# Altium schematic sheet CHECK2.SchDoc
size A4
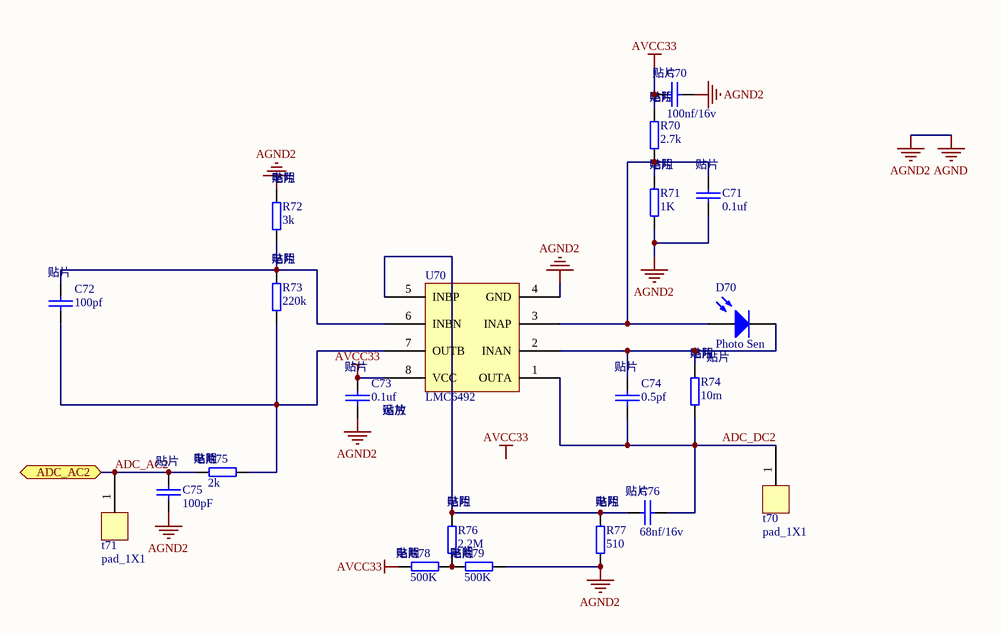
[diagram p0: CHECK2.SchDoc]

## Parts
C70  100nf/16v  [C0402]
C71  0.1uf  [C0402]
C72  100pf  [C0402]
C73  0.1uf  [C0402]
C74  0.5pf  [C0402]
C75  100pF  [C0402]
C76  68nf/16v  [C0402]
D70  Photo Sen  [PhotoSen]
R70  2.7k  [R0402]
R71  1K  [R0402]
R72  3k  [R0402]
R73  220k  [R0402]
R74  10m  [R0402]
R75  2k  [R0402]
R76  2.2M  [R0402]
R77  510  [R0402]
R78  500K  [R0402]
R79  500K  [R0402]
t70  pad_1X1  [pad_0603]
t71  pad_1X1  [pad_0603]
U70  LMC6492  [SO-8]

## Ports
ADC_AC2

## Nets
AGND: C70.2 C71.2 C73.2 C75.1 R71.2 R72.1 R77.2 R79.2 U70.4(GND)  [also labelled AGND2]
AVCC33: C70.1 C73.1 R70.1 R78.1 U70.8(VCC)
ADC_AC2: C75.2 R75.1 t71.1 ; port ADC_AC2
ADC_DC2: C74.2 C76.2 R74.2 t70.1 U70.1(OUTA)
NetC71_1: C71.1 D70.1(A) R70.2 R71.1 U70.3(INAP)
NetC72_1: C72.1 R72.2 R73.1 U70.6(INBN)
NetC72_2: C72.2 R73.2 R75.2 U70.7(OUTB)
NetC74_1: C74.1 D70.2(K) R74.1 U70.2(INAN)
NetC76_1: C76.1 R76.1 R77.1 U70.5(INBP)
NetR76_2: R76.2 R78.2 R79.1

## Notes on the sheet
- Labels drawn without touching a wire or pin: AVCC33
- (in symbol CC) 贴片
- (in symbol LMC6492) 贴片; 运放
- (in symbol Photo Sen) 贴片
- (in symbol RES1) 电阻; 贴片

## Library data of the parts
C70 C71 C73 = CC: C; 大?: 0.1uf/50v; 封?: 0603
C72 C75 = CC: C; 大?: 100pF/50v; 封?: 0603
C74 = CC: C; 大?: 0.5pf/50v; 封?: 0603
C76 = CC: C; 大?: 68nf/50v; 封?: 0603
D70 = Photo Sen: Photosensitive Diode; 产?: *; 厂?: *; 大?: *; 封?: *; 价?: *; 型?: *; 资?: *
R70-R79 = RES1: R; 价?: 0.01; 封?: 0603
  R70: 大?: 2.7k
  R71: 大?: 1k
  R72: 大?: 3k
  R73: 大?: 220k
  R74: 大?: 10m
  R75: 大?: 2k
  R76: 大?: 2.2M
  R77: 大?: 510
  R78 R79: 大?: 500K
U70 = LMC6492: 产?: *; 厂?: *; 大?: *; 封?: *; 价?: *; 型?: LMC6492; 资?: *